# EAGLE schematic termoresistenza_v1_rev0 (EAGLE 6.5.0)
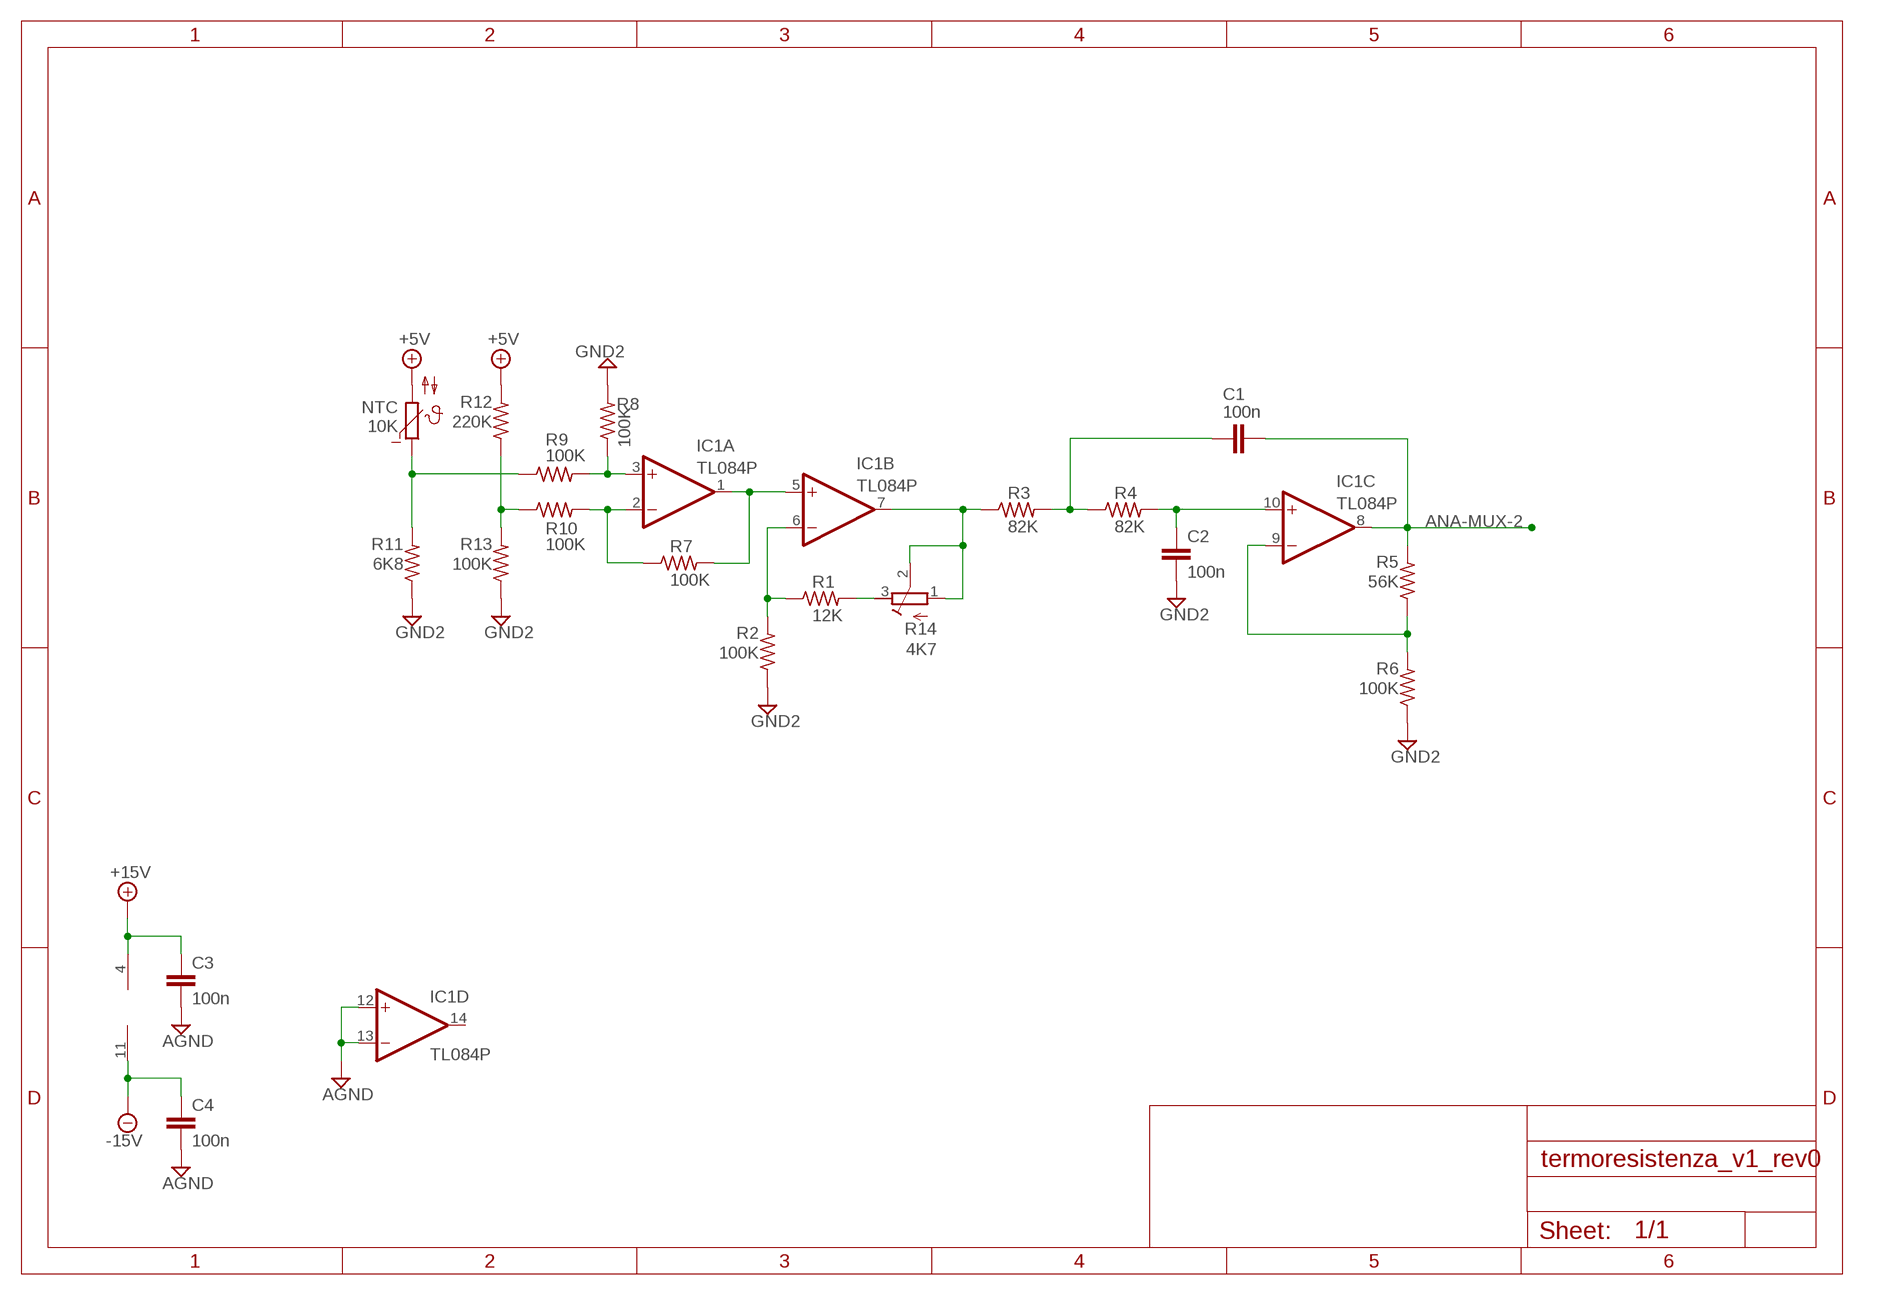
[diagram p0: schematic, sheet 1]

## Parts
C1  100n  C-EU025-025X050  [C025-025X050]
C2  100n  C-EU025-025X050  [C025-025X050]
C3  100n  C-EU025-025X050  [C025-025X050]
C4  100n  C-EU025-025X050  [C025-025X050]
IC1  TL084P  [DIL14]
NTC  10K  NTC640  [P640]
R1  12K  R-US_0204/7  [0204/7]
R2  100K  R-US_0204/7  [0204/7]
R3  82K  R-US_0204/7  [0204/7]
R4  82K  R-US_0204/7  [0204/7]
R5  56K  R-US_0204/7  [0204/7]
R6  100K  R-US_0204/7  [0204/7]
R7  100K  R-US_0204/7  [0204/7]
R8  100K  R-US_0204/7  [0204/7]
R9  100K  R-US_0204/7  [0204/7]
R10  100K  R-US_0204/7  [0204/7]
R11  6K8  R-US_0204/7  [0204/7]
R12  220K  R-US_0204/7  [0204/7]
R13  100K  R-US_0204/7  [0204/7]
R14  4K7  R-TRIMM64W  [RTRIM64W]

## Nets
+5V: NTC.2 R12.2
+15V: C3.1 IC1.4(P:V+)
-15V: C4.1 IC1.11(P:V-)
AGND: C3.2 C4.2 IC1.12(D:+IN) IC1.13(D:-IN)
ANA-MUX-2: C1.2 IC1.8(C:OUT) R5.2
GND2: C2.2 R2.1 R6.1 R8.2 R11.1 R13.1
N$1: C2.1 IC1.10(C:+IN) R4.2
N$2: IC1.2(A:-IN) R7.1 R10.2
N$3: IC1.9(C:-IN) R5.1 R6.2
N$4: IC1.3(A:+IN) R8.1 R9.2
N$5: C1.1 R3.2 R4.1
N$6: IC1.7(B:OUT) R3.1 R14.1(E) R14.2(S)
N$7: R1.2 R14.3(A)
N$8: IC1.6(B:-IN) R1.1 R2.2
N$9: IC1.1(A:OUT) IC1.5(B:+IN) R7.2
N$10: NTC.1 R9.1 R11.2
N$11: R10.1 R12.1 R13.2
Unconnected: IC1.14(D:OUT)

## Library data of the parts
C1-C4 = rcl:C-EU: CAPACITOR, European symbol
IC1 = linear:TL084: OP AMP
NTC = ptc-ntc:NTC640: PHILIPS NTC; OC_FARNELL: unknown; OC_NEWARK: unknown
R1-R13 = resistor:R-US_: RESISTOR, American symbol
R14 = resistor:R-TRIMM: Trimm resistor